# Altium schematic sheet Buck-converter-controller.SchDoc
size A4; SheetNumber: 6; SheetTotal: 6
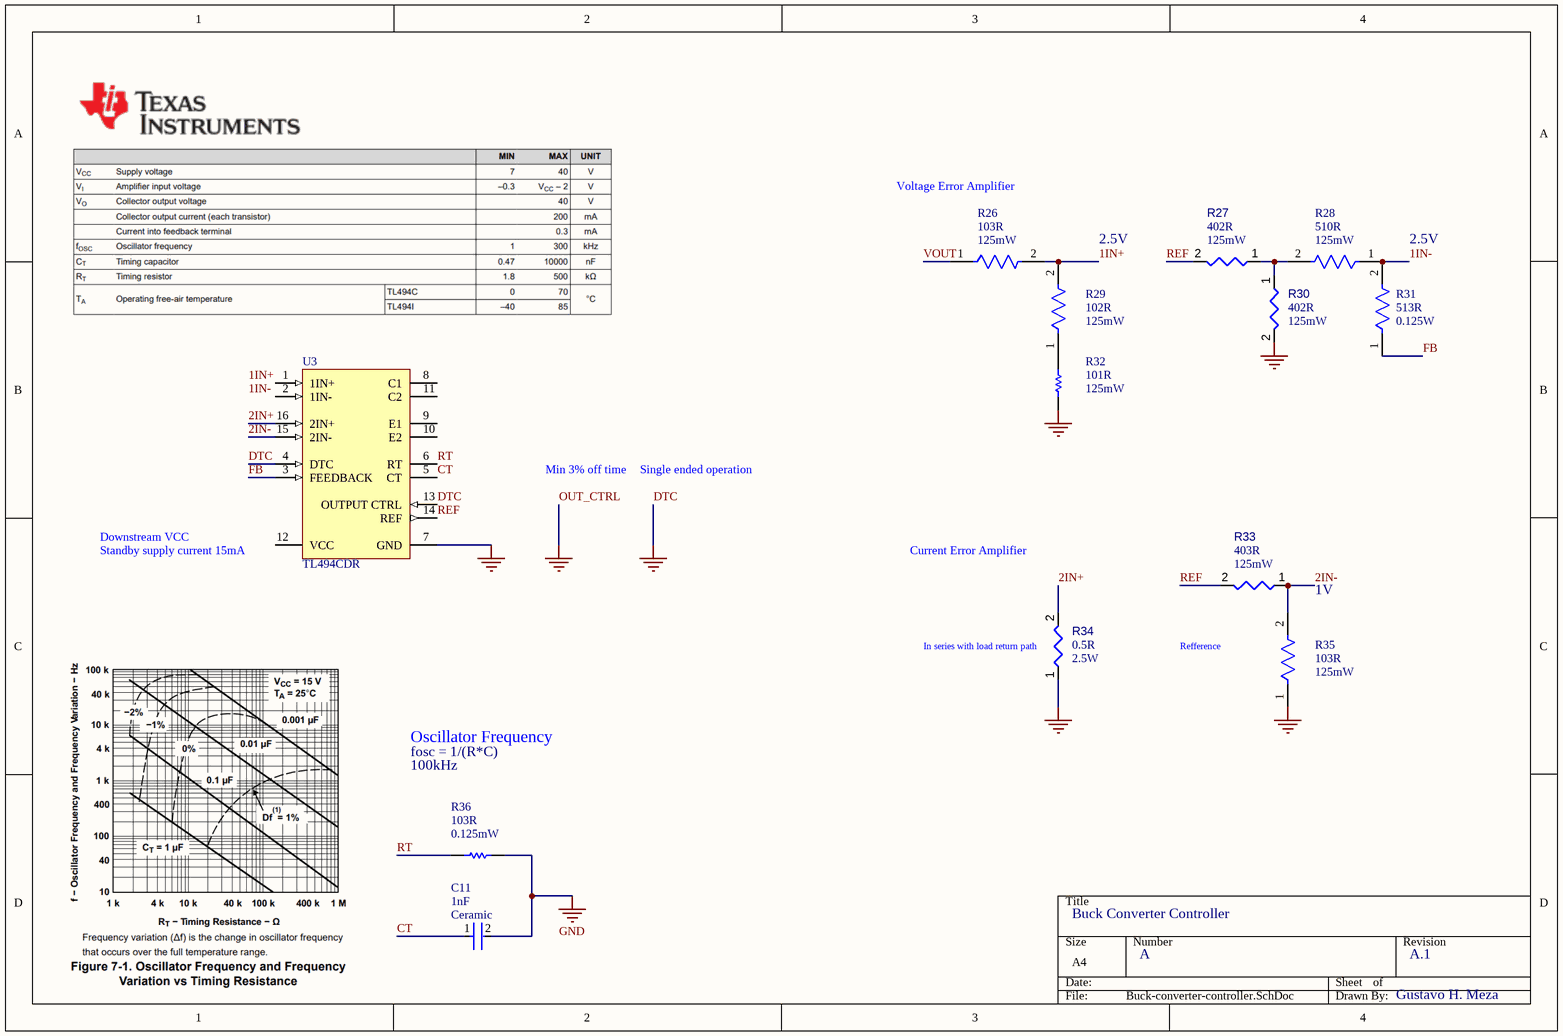
[diagram p0: Buck-converter-controller.SchDoc]

## Parts
C11  Capacitance: 1nF  Dielectric Material: Ceramic  [FP-0805-L_2_01_0_2-W_1_25-MFG]  (hidden comment: 08051A102JAT2A)
R26  Resistance: 103R  Power Rating: 125mW  [FP-CRCW0805-e3-IPC_A]  (hidden comment: CRCW080510K0FKEA)
R27  value 402R  Power: 125mW  [RESC3416X05N]  (hidden comment: CRCW08054K00FKTA)
R28  Resistance: 510R  Power Rating: 125mW  [FP-CR0805-IPC_B]  (hidden comment: CR0805JW511E)
R29  Power Rating: 125mW  Resistance: 102R  [FP-CRCW0805-e3-IPC_B]  (hidden comment: CRCW08051K00JNEA)
R30  value 402R  Power: 125mW  [RESC3416X05N]  (hidden comment: CRCW08054K00FKTA)
R31  value 513R  Power Rating: 0.125W  [FP-RT0805-MFG]  (hidden comment: RT0805BRD0751KL)
R32  Resistancemeter 1: 101R  Power: 125mW  [RESC2013X60X40ML20T25]  (hidden comment: ERA6AEB101V)
R33  value 403R  Power: 125mW  [RESC3416X05N]  (hidden comment: CRCW08054K00FKTA)
R34  value 0.5R  Power: 2.5W  [RS02CR5000FB12-Footprint-1]  (hidden comment: RS02CR5000FB12)
R35  Resistance: 103R  Max Power Dissipation: 125mW  [FP-ERA6A-IPC_C]  (hidden comment: ERA6AEB102V)
R36  Resistance: 103R  Power: 0.125mW  [RESC2013X60X35ML10T20]  (hidden comment: RC0805JR-0710KL)
U3  TL494CDR  [D0016A_N]

## Nets
DTC: C11.2 R30.2 R32.1 R34.1 R35.1 R36.2 U3.4(DTC) U3.7(GND) U3.13(OUTPUT_CTRL)  [also labelled GND, OUT_CTRL]
1IN+: R26.2 R29.2
1IN-: R28.1 R31.2
2IN+: R34.2 U3.16(2IN+)
2IN-: R33.1 R35.2 U3.15(2IN-)
CT: C11.1 U3.5(CT)
FB: R31.1 U3.3(FEEDBACK)
REF: R27.2 R33.2 U3.14(REF)
RT: R36.1 U3.6(RT)
VOUT: R26.1
NetR27_1: R27.1 R28.2 R30.1
NetR29_1: R29.1 R32.2

Not connected (* = marked no-connect by the designer): U3 1(1IN+) 2(1IN-) 8(C1) 9(E1) 10(E2) 11(C2) 12(VCC)

## Notes on the sheet
- Voltage Error Amplifier
- 2.5V
- Min 3% off time
- Single ended operation
- Downstream VCC
- (near U3) Standby supply current 15mA
- Current Error Amplifier
- (near R34) In series with load return path
- Refference
- 1V
- fosc = 1/(R*C)
- 100kHz
- Oscillator Frequency
- Buck Converter Controller
- A
- A.1
- Gustavo H. Meza
- Labels drawn without touching a wire or pin: 1IN+, 1IN-

## Library data of the parts
C11 = CMP-2007-04527-2: General Purpose Ceramic Capacitor, 0805, 1nF, 5%, C0G, 30ppm/°C, 100V; Insulation Resistance: 100GR; Dissipation Factor: 2.5%; Mount: Surface Mount; Package Quantity: 1; Voltage: 100V; Lead Free: Lead Free; Case/Package: 0805; Voltage Rating: 100V; Dielectric: C0G; Case Code (Metric): 2012; Case Code (Imperial): 0805; REACH SVHC: No SVHC; Number of Pins: 2; Length: 2.01mm; Temperature Coefficient: 30ppm/°C; Depth: 1.25mm; Radiation Hardening: No; RoHS Compliant: Yes; Packaging: Tape and Reel; Min Operating Temperature: -55°C; Contact Plating: Tin; Tolerance: 5%; Termination: SMD/SMT; Height: 0.94mm; Thickness: 0.037inch; Voltage Rating (DC): 100V; Max Operating Temperature: 125°C; Width: 1.25mm
R26 = CMP-2001-04908-2: RES Thick Film, 10kΩ, 1%, 0.125W, 100ppm/°C, 0805; Voltage Rating (DC): 150V; Weight: 0.000194oz; Package Quantity: 5000; Military Standard: Not; Max Operating Temperature: 155°C; Temperature Coefficient: 100ppm/°C; Contact Plating: Tin; Width: 1.25mm; Height: 0.45mm; Radiation Hardening: No; Tolerance: 1%; Min Operating Temperature: -55°C; Voltage Rating: 150V; Length: 2mm; Depth: 1.25mm; Termination: SMD/SMT; Packaging: Tape and Reel; Case/Package: 0805; Case Code (Metric): 2012; Lead Free: Lead Free; Case Code (Imperial): 0805; Composition: Thick Film
R27 R30 R33 = CMP-009-00184-1: RES SMD 4K OHM 1% 1/8W 0805; Manufacturer Series: CRCW; Min Operating Temperature: -55°C; Mounting Technology: Surface Mount; Case/Package: 0805; RoHS Compliant: No; Pins: 2; Tolerance: 1%; JESD-609 Code: e0; Max Operating Temperature: 155°C
R28 = CMP-07231-001106-1: Thick Film Chip Resistors 0805 510Ω 0.125W 5% 200ppm/°C; Voltage Rating: 150V; Case Code (Imperial): 0805; Case Code (Metric): 2012; Max Operating Temperature: 155°C; Packaging: Tape and Reel; Termination: SMD/SMT; Thickness: 508um; Min Operating Temperature: -55°C; Tolerance: 5%; Height: 0.5mm; Width: 1.25mm; Length: 2mm; Case/Package: 0805; Temperature Coefficient: 200ppm/°C; Package Quantity: 5000
R29 = CMP-2001-03597-2: RES Thick Film, 1kΩ, 5%, 0.125W, 200ppm/°C, 0805; Voltage Rating: 150V; Depth: 1.25mm; Features: Automotive AEC-Q200; Case/Package: 0805; Lead Free: Lead Free; Width: 1.25mm; Temperature Coefficient: 200ppm/°C; Height: 0.02inch; Length: 2mm; Case Code (Metric): 2012; Mount: Surface Mount; Military Standard: Not; Contact Plating: Tin; Min Operating Temperature: -55°C; Number of Pins: 2; Weight: 0.000194oz; Case Code (Imperial): 0805; Packaging: Tape and Reel; Voltage Rating (DC): 150V; Number of Terminations: 2; Composition: Thick Film; Radiation Hardening: No; Tolerance: 5%; Package Quantity: 1; Max Power Dissipation: 125mW; Max Operating Temperature: 155°C; Termination: SMD/SMT
R31 = CMP-03412-030464-1: RES SMD 51K OHM 0.1% 1/8W 0805; Manufacturer: Yageo; Tolerance: 0.0025; Temperature Coefficient: 25 ppm/°C; Voltage Rating: 150V; Device Class L1: Passive Components; Mouser Description: Thin Film Resistors - SMD 1/8W 51K ohm .1% 25ppm; Temperature: -55°C to +155°C; Series: RT; RoHS: TRUE; ComponentLink2Description: Datasheet; Ipc Land Pattern Name: RESC200125X50; Digikey Description: RES SMD 51K OHM 0.1% 1/8W 0805; Category: Res; Temperature Range Low: -55°C; Package: RT0805; Manufacturer Part Number: RT0805BRD0751KL; ComponentLink2URL: http://www.yageo.com/documents/recent/PYu-RT_1-to-0.01_RoHS_L_9.pdf; Device Class L3: Chip SMD Resistors; Height: 0.6mm; Octopart: https://octopart.com/rt0805brd0751kl-yageo-1414977; Resistance: 51k; Footprint Url: http://www.yageo.com/exep/pages/download/literatures/PYu-R_Mount_10.pdf; Composition: Thin Film; Device Class L2: Resistors; Lead Free: Yes; Temperature Range High: +155°C; Automotive: No
R32 = CMP-2001-00580-1: Manufacturer: Panasonic; Part Number: ERA6AEB101V
R34 = CMP-009-00190-1: Fixed Resistor, Wire Wound, 2.5W, 0.5ohm, 1% +/-Tol, 90ppm/Cel, Through Hole Mount; Manufacturer Series: RS; Additional Feature: PRECISION; RoHS Compliant: No; Max Operating Temperature: 250°C; JESD-609 Code: e0; Pins: 2; Tolerance: 1%; Min Operating Temperature: -65°C; Mounting Technology: Through Hole
R35 = CMP-2001-00581-2: RES 1K OHM 0.1% 1/8W 0805; Temperature Coefficient: 25ppm/°C; Working Voltage: 100V; Height: 0.5mm; Technology: THIN FILM; REACH SVHC: No SVHC; Packaging: Tape and Reel; Length: 2mm; Width: 1.25mm; Resistance Tolerance: 0.1%; Series: ERA-6A; Resistor Type: Thin Film; Number of Pins: 2; Case Code (Metric): 2012; Voltage Rating: 100V; Radiation Hardening: No; Construction: Rectangular; Mount: Surface Mount; Number of Terminations: 2; Case/Package: 0805; Min Operating Temperature: -55°C; Military Standard: Not; RoHS Compliant: Yes; Termination: SMD/SMT; Case Code (Imperial): 0805; Depth: 1.25mm; Power Rating: 125mW; Max Operating Temperature: 155°C; Contact Plating: Tin; Package Quantity: 5000; Tolerance: 0.1%
R36 = CMP-2000-05025-1: Chip Resistor, 10 KOhm, +/- 5%, 0.125 W, -55 to 155 degC, 0805 (2012 Metric), RoHS, Tape and Reel; Manufacturer: Yageo; Resistor Element Type: ThickFilm; Voltage Rating: 150V; Product Range: RCSeries; SVHC: ToBeAdvised; Resistor Case Style: 0805[2012Metric]; Temperature Coefficient: ±100ppm/degC; Power Rating: 250mW; Automotive Qualification Standard: -; Datasheet Version: REV. 2, 09/2004; Packaging: CutTape; Resistance Tolerance: ±5%; MSL: MSL1-Unlimited; Manufacturer URL: http://www.yageo.com/; Datasheet URL: http://www.yageo.ru/pdf/RC0805.pdf; Package Description: 2-Pin Surface Mounted Device, Body 2 x 1.25 mm; Package Reference: 805
U3 = CMP-0319-00950-2: Pulse-Width-Modulation Control Circuit with Voltage Control, 45 % Duty Cycle, 0 to +70 degC, 16-pin SOIC (D), Green (RoHS & no Sb/Br); Manufacturer: Texas Instruments; Regulated Outputs(#): 2; Frequency(Max)(kHz): 300; Topology: Boost, Buck, Flyback, Forward, Full-Bridge, Half-Bridge, Push-Pull; SubFamily: PWM Controller; Duty Cycle(Max)(%): 45; Rating: Military; PackageDescription: 16-Pin Plastic Small Outline Integrated Circuit, 9.9 x 3.9 mm, Pitch 1.27 mm Pitch; Mounting Technology: Surface Mount; PackageReference: D0016A; DatasheetVersion: SLVS074E; Control Method: Voltage; ComponentLink1Description: Datasheet; ComponentLink1URL: http://www.ti.com/general/docs/lit/getliterature.tsp?genericPartNumber=TL494&fileType=pdf; Code_JEDEC: MS-012AC; Eco-Plan: Green (RoHS & no Sb/Br); PackageVersion: revM, Jun-2011; PartNumber: TL494CDR